# EAGLE schematic SEWERYN_GŁADYSZ_F1_DASHBOARD_SCHEMA_v3 (EAGLE 9.7.0)
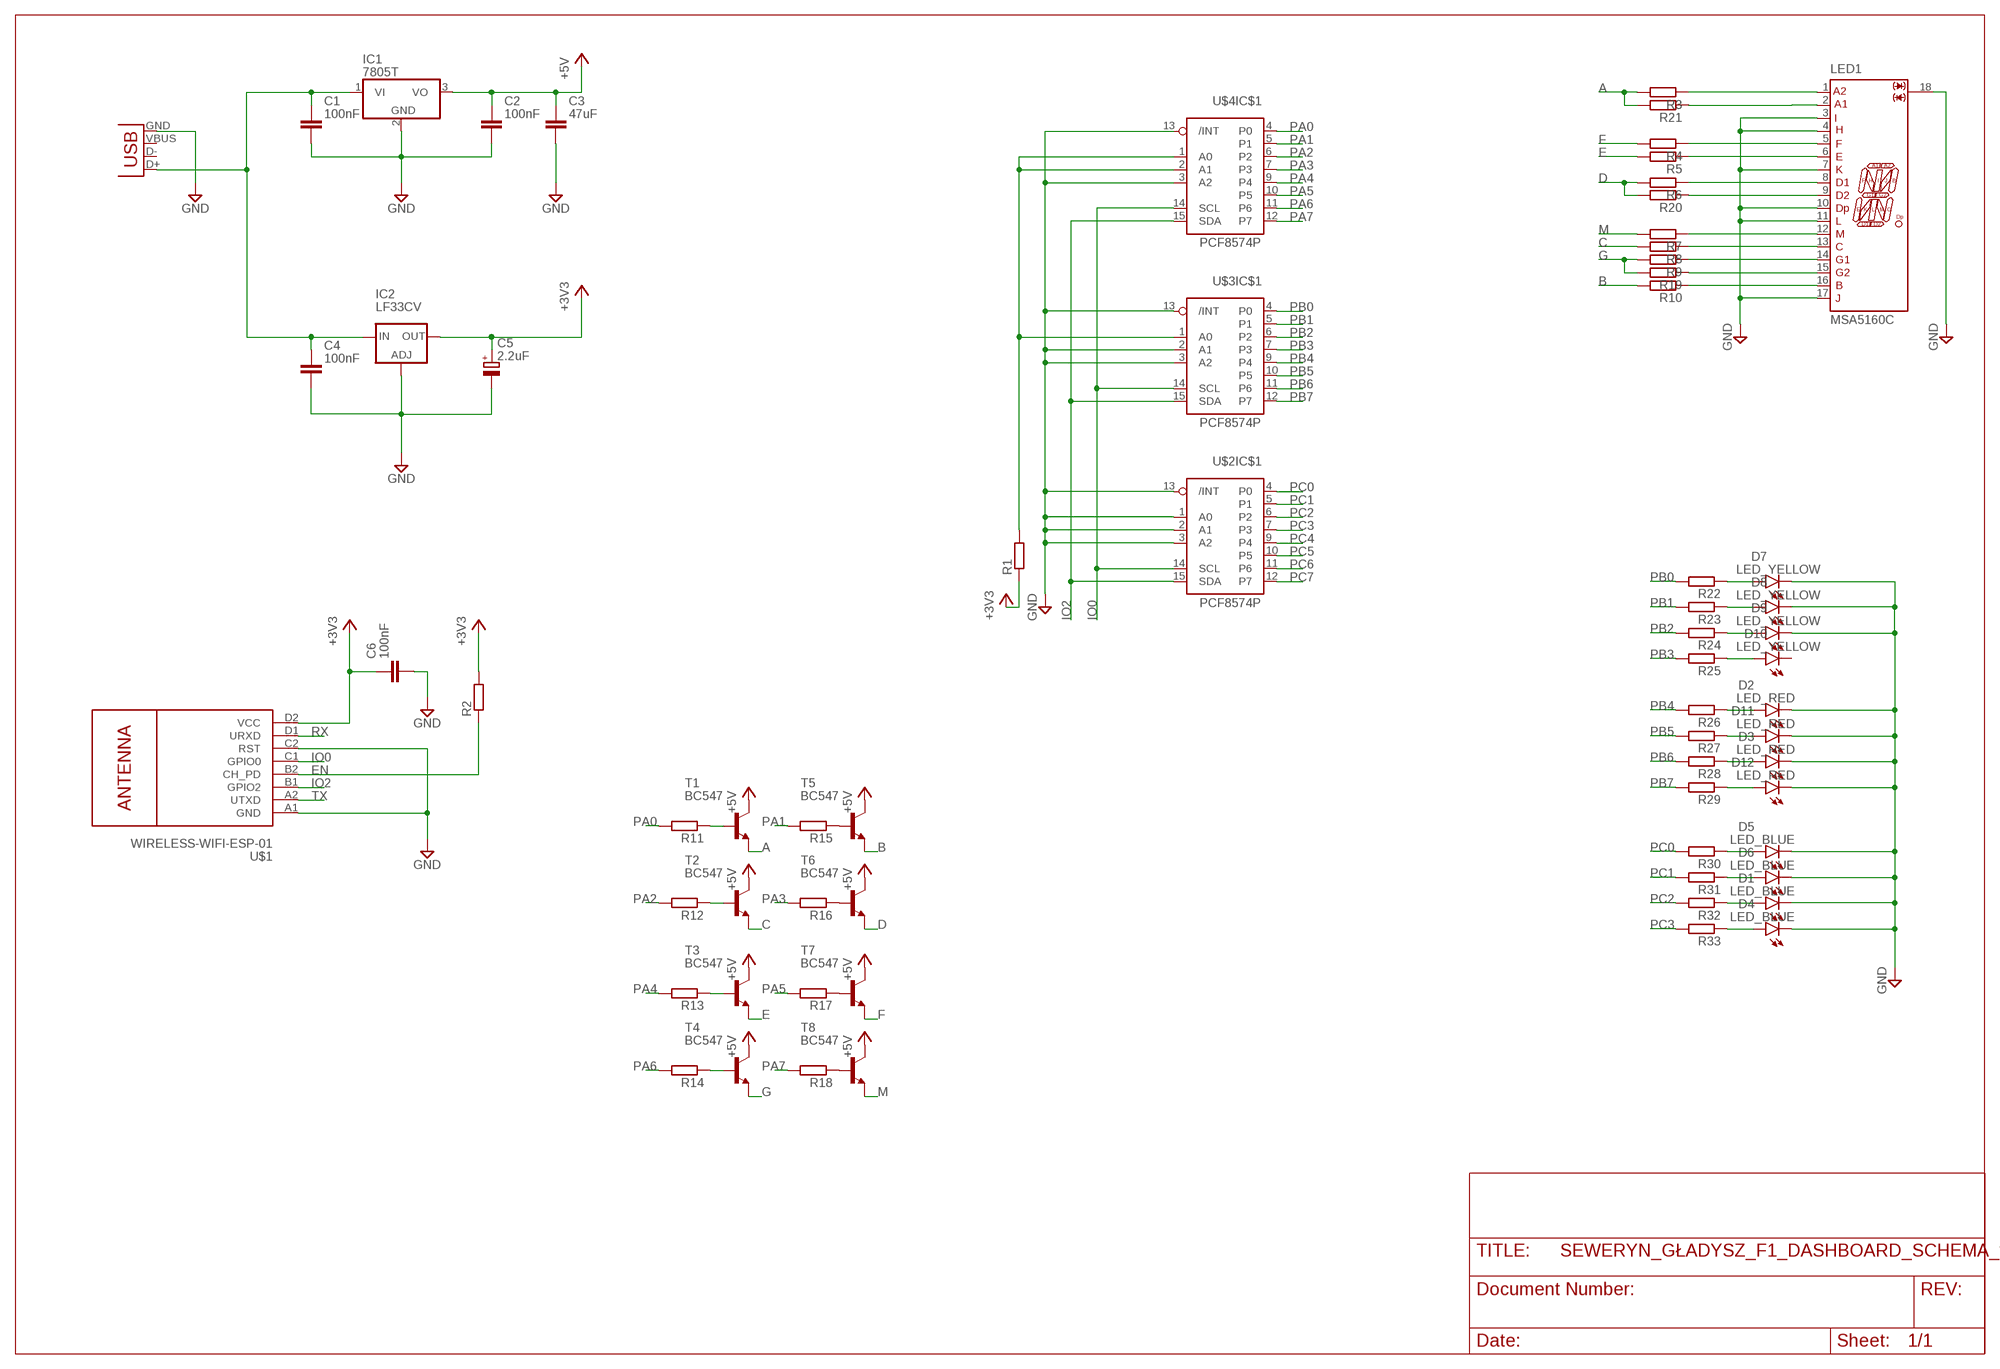
[diagram p0: schematic, sheet 1]

## Parts
C1  100nF  C_RADIAL-12.5MM-DIA  [CAPRD550W60D1025H1250B]
C2  100nF  C_RADIAL-12.5MM-DIA  [CAPRD550W60D1025H1250B]
C3  47uF  C_RADIAL-12.5MM-DIA  [CAPRD550W60D1025H1250B]
C4  100nF  C_RADIAL-12.5MM-DIA  [CAPRD550W60D1025H1250B]
C5  2.2uF  C-POL_RADIAL-25MM-DIA  [CAPPRD550W110D1250H2500B]
C6  100nF  C_RADIAL-12.5MM-DIA  [CAPRD550W60D1025H1250B]
D1  LED_BLUE  LED_RADIAL_BLUE  [LEDRD254W60D565H860B_B]
D2  LED_RED  LED_RADIAL_RED  [LEDRD254W60D565H860B]
D3  LED_RED  LED_RADIAL_RED  [LEDRD254W60D565H860B]
D4  LED_BLUE  LED_RADIAL_BLUE  [LEDRD254W60D565H860B_B]
D5  LED_BLUE  LED_RADIAL_BLUE  [LEDRD254W60D565H860B_B]
D6  LED_BLUE  LED_RADIAL_BLUE  [LEDRD254W60D565H860B_B]
D7  LED_YELLOW  LED_RADIAL_YELLOW  [LEDRD254W60D565H860B_Y]
D8  LED_YELLOW  LED_RADIAL_YELLOW  [LEDRD254W60D565H860B_Y]
D9  LED_YELLOW  LED_RADIAL_YELLOW  [LEDRD254W60D565H860B_Y]
D10  LED_YELLOW  LED_RADIAL_YELLOW  [LEDRD254W60D565H860B_Y]
D11  LED_RED  LED_RADIAL_RED  [LEDRD254W60D565H860B]
D12  LED_RED  LED_RADIAL_RED  [LEDRD254W60D565H860B]
IC1  7805T  [TO220H]
IC2  LF33CV  LM317TS  [317TS]
LED1  MSA5160C  [MSA5XXX]
R1  R-EU_0207/10  [0207/10]
R2  R-EU_0207/10  [0207/10]
R3  R-EU_0207/10  [0207/10]
R4  R-EU_0207/10  [0207/10]
R5  R-EU_0207/10  [0207/10]
R6  R-EU_0207/10  [0207/10]
R7  R-EU_0207/10  [0207/10]
R8  R-EU_0207/10  [0207/10]
R9  R-EU_0207/10  [0207/10]
R10  R-EU_0207/10  [0207/10]
R11  R-EU_0207/10  [0207/10]
R12  R-EU_0207/10  [0207/10]
R13  R-EU_0207/10  [0207/10]
R14  R-EU_0207/10  [0207/10]
R15  R-EU_0207/10  [0207/10]
R16  R-EU_0207/10  [0207/10]
R17  R-EU_0207/10  [0207/10]
R18  R-EU_0207/10  [0207/10]
R19  R-EU_0207/10  [0207/10]
R20  R-EU_0207/10  [0207/10]
R21  R-EU_0207/10  [0207/10]
R22  R-EU_0207/10  [0207/10]
R23  R-EU_0207/10  [0207/10]
R24  R-EU_0207/10  [0207/10]
R25  R-EU_0207/10  [0207/10]
R26  R-EU_0207/10  [0207/10]
R27  R-EU_0207/10  [0207/10]
R28  R-EU_0207/10  [0207/10]
R29  R-EU_0207/10  [0207/10]
R30  R-EU_0207/10  [0207/10]
R31  R-EU_0207/10  [0207/10]
R32  R-EU_0207/10  [0207/10]
R33  R-EU_0207/10  [0207/10]
T1  BC547  [TO92]
T2  BC547  [TO92]
T3  BC547  [TO92]
T4  BC547  [TO92]
T5  BC547  [TO92]
T6  BC547  [TO92]
T7  BC547  [TO92]
T8  BC547  [TO92]
U$1  WIRELESS-WIFI-ESP-01  [WIRELESS-WIFI-ESP-01]
U$2  PCF8574P  [DIL16]
U$3  PCF8574P  [DIL16]
U$4  PCF8574P  [DIL16]
X1  USB-A-H  [USB-A-H]

## Nets
+3V3: C5.1(+) C6.1 IC2.2(OUT) R1.1 R2.2 U$1.D2(VCC)
+5V: C2.1 C3.1 IC1.3(VO) T1.3(C) T2.3(C) T3.3(C) T4.3(C) T5.3(C) T6.3(C) T7.3(C) T8.3(C)
A: LED1.1 R3.1 R3.2 R21.2 T1.1(E)
B: LED1.16 R10.1 R10.2 T5.1(E)
C: LED1.13 R8.1 R8.2 T2.1(E)
D: LED1.8 R6.1 R6.2 R20.2 T6.1(E)
E: LED1.6 R5.1 R5.2 T3.1(E)
EN: R2.1 U$1.B2(CH_PD)
F: LED1.5 R4.1 R4.2 T7.1(E)
G: LED1.14 R9.1 R9.2 R19.2 T4.1(E)
GND: C1.2 C2.2 C3.2 C4.2 C5.2(-) C6.2 D1.2(C) D2.2(C) D3.2(C) D4.2(C) D5.2(C) D6.2(C) D7.2(C) D8.2(C) D9.2(C) D11.2(C) D12.2(C) IC1.2(GND) IC2.1(ADJ) LED1.3 LED1.4 LED1.7 LED1.10 LED1.11 LED1.17 LED1.18 U$1.A1(GND) U$1.C2(RST) U$2.1(IC$1:A0) U$2.2(IC$1:A1) U$2.3(IC$1:A2) U$2.13(IC$1:/INT) U$3.2(IC$1:A1) U$3.3(IC$1:A2) U$3.13(IC$1:/INT) U$4.3(IC$1:A2) U$4.13(IC$1:/INT) X1.GND
IO0 [IO0]: U$1.C1(GPIO0) U$2.14(IC$1:SCL) U$3.14(IC$1:SCL) U$4.14(IC$1:SCL)
IO2: U$1.B1(GPIO2) U$2.15(IC$1:SDA) U$3.15(IC$1:SDA) U$4.15(IC$1:SDA)
M: LED1.12 R7.1 R7.2 T8.1(E)
N$1: C1.1 C4.1 IC1.1(VI) IC2.3(IN) X1.D+
N$2: R1.2 U$3.1(IC$1:A0) U$4.1(IC$1:A0) U$4.2(IC$1:A1)
N$3: R15.1 T5.2(B)
N$4: R16.1 T6.2(B)
N$5: R17.1 T7.2(B)
N$6: R18.1 T8.2(B)
N$7: R11.1 T1.2(B)
N$8: R12.1 T2.2(B)
N$9: R13.1 T3.2(B)
N$10: R14.1 T4.2(B)
N$11: LED1.15 R19.1
N$12: LED1.9 R20.1
N$13: LED1.2 R21.1
N$14: D7.1(A) R22.1
N$15: D8.1(A) R23.1
N$16: D9.1(A) R24.1
N$17: D10.1(A) R25.1
N$18: D2.1(A) R26.1
N$19: D11.1(A) R27.1
N$20: D3.1(A) R28.1
N$21: D12.1(A) R29.1
N$22: D5.1(A) R30.1
N$23: D6.1(A) R31.1
N$24: D1.1(A) R32.1
N$25: D4.1(A) R33.1
PA0: R11.2 U$4.4(IC$1:P0)
PA1: R15.2 U$4.5(IC$1:P1)
PA2: R12.2 U$4.6(IC$1:P2)
PA3: R16.2 U$4.7(IC$1:P3)
PA4: R13.2 U$4.9(IC$1:P4)
PA5: R17.2 U$4.10(IC$1:P5)
PA6: R14.2 U$4.11(IC$1:P6)
PA7: R18.2 U$4.12(IC$1:P7)
PB0: R22.2 U$3.4(IC$1:P0)
PB1: R23.2 U$3.5(IC$1:P1)
PB2: R24.2 U$3.6(IC$1:P2)
PB3: R25.2 U$3.7(IC$1:P3)
PB4: R26.2 U$3.9(IC$1:P4)
PB5: R27.2 U$3.10(IC$1:P5)
PB6: R28.2 U$3.11(IC$1:P6)
PB7: R29.2 U$3.12(IC$1:P7)
PC0: R30.2 U$2.4(IC$1:P0)
PC1: R31.2 U$2.5(IC$1:P1)
PC2: R32.2 U$2.6(IC$1:P2)
PC3: R33.2 U$2.7(IC$1:P3)
PC4: U$2.9(IC$1:P4)
PC5: U$2.10(IC$1:P5)
PC6: U$2.11(IC$1:P6)
PC7: U$2.12(IC$1:P7)
RX: U$1.D1(URXD)
TX: U$1.A2(UTXD)
Unconnected: D10.2(C) X1.D- X1.VBUS

## Power pins joined to a net without a drawn wire
GND: U$2.8(PWR:GND) U$3.8(PWR:GND) U$4.8(PWR:GND)
VCC: U$2.16(PWR:VCC) U$3.16(PWR:VCC) U$4.16(PWR:VCC)

## Library data of the parts
C1-C4 C6 = Capacitor:C: Capacitor - Generic; CATEGORY: Capacitor
C5 = Capacitor:C-POL: Capacitor Polarised - Generic; CATEGORY: Capacitor
D1-D12 = Opto-Electronic:LED_RADIAL: LED - Generic; CATEGORY: Opto-Electronic; SUB-CATEGORY: LED
IC1 = adafruit:78*: Positive VOLTAGE REGULATOR Added bigger pads to the TO-92 package
IC2 = v-reg:LM317TS: VOLTAGE REGULATOR
LED1 = led:MSA5*C: 16 Segment, Single Digit Alpha-Numeric Display 0.5 Inch (12.7 mm) Source: www.fairchildsemi.com/ds/MS/MSA5480C.pdf
R1-R33 = rcl:R-EU_: RESISTOR, European symbol; SPICEPREFIX: R
T1-T8 = transistor:BC547: NPN TRANSISTOR
U$1 = diy-modules:WIRELESS-WIFI-ESP-01: Wireless Wi-Fi ESP-01 Module based on ESP8266 chip Click here to find device on ebay.com <http://www.ebay.com/sch/esp8266+esp+01+transceiver>
U$2-U$4 = i2c:PCF8574: Remote 8-Bit I/O Expander for I²C Bus
X1 = con-usb:USB: USB Connectors